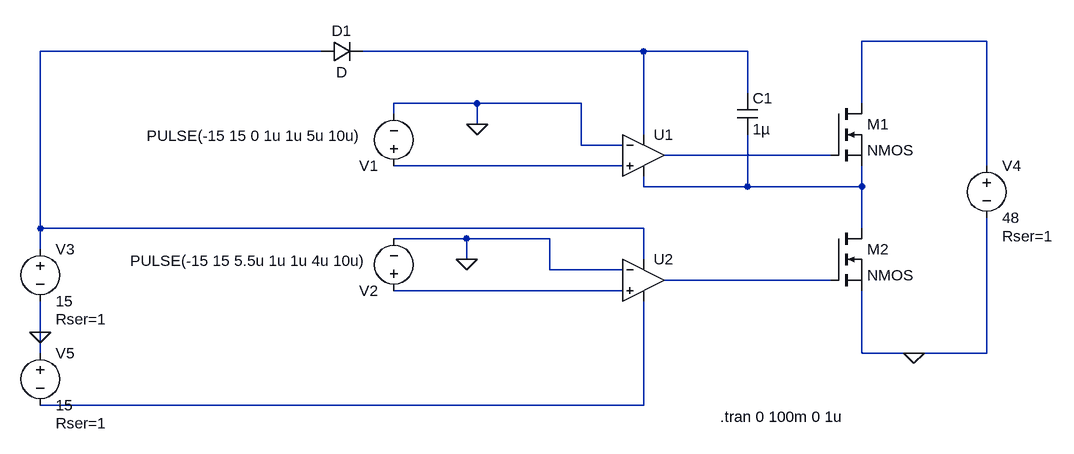
[diagram p0: schematic Draft1.asc]
Draft1.asc, the LTspice schematic file:
Version 4
SHEET 1 880 680
WIRE 752 -32 560 -32
WIRE -272 -16 -704 -16
WIRE 224 -16 -208 -16
WIRE 384 -16 224 -16
WIRE 384 48 384 -16
WIRE -32 64 -160 64
WIRE 128 64 -32 64
WIRE 560 64 560 -32
WIRE -160 80 -160 64
WIRE -32 96 -32 64
WIRE 224 112 224 -16
WIRE 128 128 128 64
WIRE 192 128 128 128
WIRE 512 144 256 144
WIRE 192 160 -160 160
WIRE 752 160 752 -32
WIRE 224 192 224 176
WIRE 384 192 384 112
WIRE 384 192 224 192
WIRE 560 192 560 160
WIRE 560 192 384 192
WIRE -704 256 -704 -16
WIRE 224 256 -704 256
WIRE 560 256 560 192
WIRE -48 272 -160 272
WIRE 80 272 -48 272
WIRE -704 288 -704 256
WIRE -48 304 -48 272
WIRE 224 304 224 256
WIRE 80 320 80 272
WIRE 192 320 80 320
WIRE 512 336 256 336
WIRE 192 352 -160 352
WIRE -704 416 -704 368
WIRE -704 448 -704 416
WIRE 560 448 560 352
WIRE 640 448 560 448
WIRE 752 448 752 240
WIRE 752 448 640 448
WIRE 224 528 224 368
WIRE 224 528 -704 528
FLAG -32 96 0
FLAG -48 304 0
FLAG -704 416 0
FLAG 640 448 0
SYMBOL Opamps\\UniversalOpamp2 224 144 R0
SYMATTR InstName U1
SYMBOL voltage -160 176 R180
WINDOW 3 48 62 Left 2
WINDOW 123 0 0 Left 2
WINDOW 39 0 0 Left 2
SYMATTR InstName V1
SYMATTR Value PULSE(-15 15 0 1u 1u 5u 10u)
SYMBOL voltage -160 368 R180
WINDOW 3 40 62 Left 2
WINDOW 123 0 0 Left 2
WINDOW 39 0 0 Left 2
SYMATTR InstName V2
SYMATTR Value PULSE(-15 15 5.5u 1u 1u 4u 10u)
SYMBOL Opamps\\UniversalOpamp2 224 336 R0
SYMATTR InstName U2
SYMBOL voltage -704 272 R0
WINDOW 123 0 0 Left 2
WINDOW 39 24 124 Left 2
SYMATTR InstName V3
SYMATTR Value 15
SYMATTR SpiceLine Rser=1
SYMBOL diode -272 0 R270
WINDOW 0 32 32 VTop 2
WINDOW 3 0 32 VBottom 2
SYMATTR InstName D1
SYMBOL nmos 512 64 R0
SYMATTR InstName M1
SYMBOL nmos 512 256 R0
SYMATTR InstName M2
SYMBOL cap 368 48 R0
SYMATTR InstName C1
SYMATTR Value 1µ
SYMATTR SpiceLine V=200 Irms=10 Rser=1
SYMBOL voltage 752 144 R0
WINDOW 123 0 0 Left 2
WINDOW 39 24 124 Left 2
SYMATTR InstName V4
SYMATTR Value 48
SYMATTR SpiceLine Rser=1
SYMBOL voltage -704 432 R0
WINDOW 123 0 0 Left 2
WINDOW 39 24 124 Left 2
SYMATTR InstName V5
SYMATTR Value 15
SYMATTR SpiceLine Rser=1
TEXT 342 546 Left 2 !.tran 0 100m 0 1u

The netlist it stands for:
* Draft1.asc
XU1 N005 0 N003 N006 N004 level.2 Avol=1Meg GBW=10Meg Slew=10Meg ilimit=25m rail=0 Vos=0 phimargin=45 en=0 enk=0 in=0 ink=0 Rin=500Meg  ; pins IN+ IN- V+ V- OUT
V1 N005 0 PULSE(-15 15 0 1u 1u 5u 10u)
V2 N008 0 PULSE(-15 15 5.5u 1u 1u 4u 10u)
XU2 N008 0 N002 N009 N007 level.2 Avol=1Meg GBW=10Meg Slew=10Meg ilimit=25m rail=0 Vos=0 phimargin=45 en=0 enk=0 in=0 ink=0 Rin=500Meg  ; pins IN+ IN- V+ V- OUT
V3 N002 0 15 Rser=1
D1 N002 N003 D
M1 N001 N004 N006 N006 NMOS
M2 N006 N007 0 0 NMOS
C1 N003 N006 1µ V=200 Irms=10 Rser=1
V4 N001 0 48 Rser=1
V5 0 N009 15 Rser=1
.model D D
.lib standard.dio
.model NMOS NMOS
.model PMOS PMOS
.lib standard.mos
.tran 0 100m 0 1u
.lib UniversalOpamps2.sub
.backanno
.end